# EAGLE design SimpleExt (EAGLE 6.1)
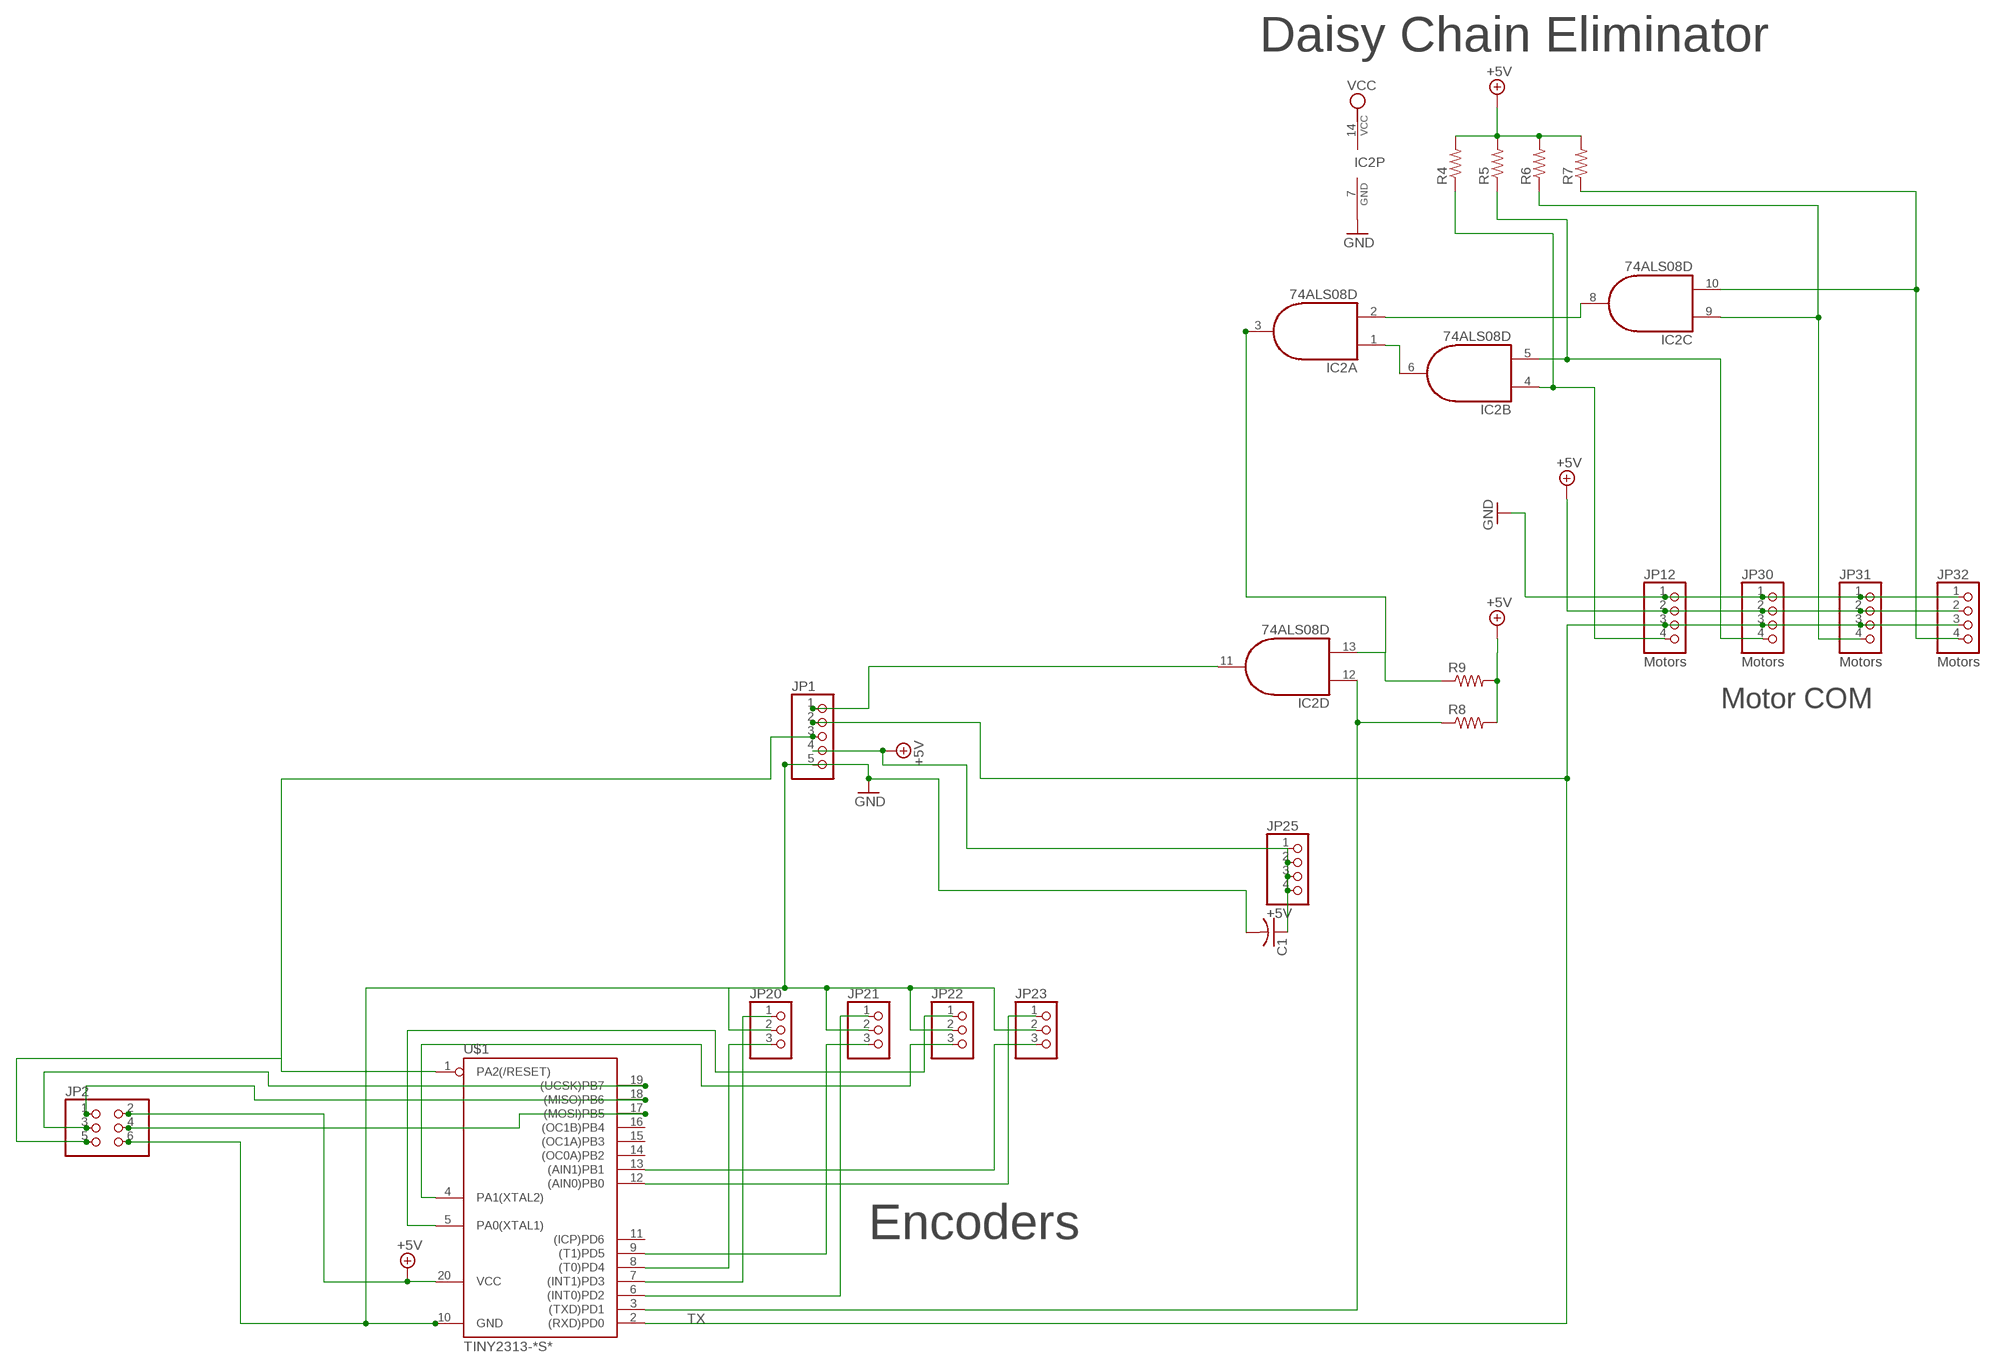
[diagram p0: schematic, sheet 1]

## Parts
C1  C-USC0603K  [C0603K]
IC2  74ALS08D  [SO14]
JP1  PINHD-1X5  [1X05]
JP2  PINHD-2X3  [2X03]
JP12  Motors  PINHD-1X04_2.54-S  [1X04-S]
JP20  PINHD-1X03_2.54-S  [1X03-S]
JP21  PINHD-1X03_2.54-S  [1X03-S]
JP22  PINHD-1X03_2.54-S  [1X03-S]
JP23  PINHD-1X03_2.54-S  [1X03-S]
JP25  +5V  PINHD-1X04_2.54-S  [1X04-S]
JP30  Motors  PINHD-1X04_2.54-S  [1X04-S]
JP31  Motors  PINHD-1X04_2.54-S  [1X04-S]
JP32  Motors  PINHD-1X04_2.54-S  [1X04-S]
R4  R-US_R0603  [R0603]
R5  R-US_R0603  [R0603]
R6  R-US_R0603  [R0603]
R7  R-US_R0603  [R0603]
R8  R-US_R0603  [R0603]
R9  R-US_R0603  [R0603]
U$1  TINY2313-*S*  [SO20L$]

## Nets
+5V [power]: C1.1 JP1.4 JP2.2 JP12.2 JP25.1 JP25.2 JP25.3 JP25.4 JP30.2 JP31.2 JP32.2 R4.2 R5.2 R6.2 R7.2 R8.2 R9.2 U$1.20(VCC)
GND [power]: C1.2 IC2.7(P:GND) JP1.5 JP2.6 JP12.1 JP20.2 JP21.2 JP22.2 JP23.2 JP30.1 JP31.1 JP32.1 U$1.10(GND)
N$1: IC2.11(D:O) JP1.1
N$3: JP2.3 U$1.19((UCSK)PB7)
N$4: IC2.10(C:I1) JP32.4 R7.1
N$5: IC2.9(C:I0) JP31.4 R6.1
N$6: JP2.1 U$1.18((MISO)PB6)
N$8: IC2.1(A:I0) IC2.6(B:O)
N$9: IC2.2(A:I1) IC2.8(C:O)
N$10: IC2.4(B:I0) JP12.4 R4.1
N$11: IC2.12(D:I0) R8.1 U$1.3((TXD)PD1)
N$12: JP20.1 U$1.7((INT1)PD3)
N$14: JP21.1 U$1.6((INT0)PD2)
N$15: JP23.3 U$1.13((AIN1)PB1)
N$16: JP20.3 U$1.8((T0)PD4)
N$17: JP21.3 U$1.9((T1)PD5)
N$18: JP2.4 U$1.17((MOSI)PB5)
N$21: JP23.1 U$1.12((AIN0)PB0)
N$22: JP22.3 U$1.4(PA1(XTAL2))
N$23: JP22.1 U$1.5(PA0(XTAL1))
N$24: IC2.5(B:I1) JP30.4 R5.1
RESET#: JP1.3 JP2.5 U$1.1(PA2(/RESET))
RXD0/IO20*: IC2.3(A:O) IC2.13(D:I1) R9.1
TX: JP1.2 JP12.3 JP30.3 JP31.3 JP32.3 U$1.2((RXD)PD0)
Unconnected: U$1.11((ICP)PD6) U$1.14((OC0A)PB2) U$1.15((OC1A)PB3) U$1.16((OC1B)PB4)

## Notes on the sheet
- Daisy Chain Eliminator
- Motor COM
- Encoders

## Power pins joined to a net without a drawn wire
VCC: IC2.14(P:VCC)

## Library data of the parts
C1 = rcl:C-US: CAPACITOR, American symbol
IC2 = 74xx-us:74*08: Quad 2-input AND gate
JP1 = pinhead:PINHD-1X5: PIN HEADER
JP2 = pinhead:PINHD-2X3: PIN HEADER
JP12 JP25 JP30-JP32 = pinhead-2:PINHD-1X04: PIN HEADER
JP20-JP23 = pinhead-2:PINHD-1X03: PIN HEADER
R4-R9 = rcl:R-US_: RESISTOR, American symbol
U$1 = avr-6:TINY2313*: Atmel Tiny2313 2K Flash, 128 bytes EEPROM, 128 bytes RAM

## Net classes
0 default: width 0.254 mm, drill 0.381 mm, clearance 0.203 mm
1 power: width 0.406 mm, drill 0.381 mm, clearance 0.203 mm

## Board
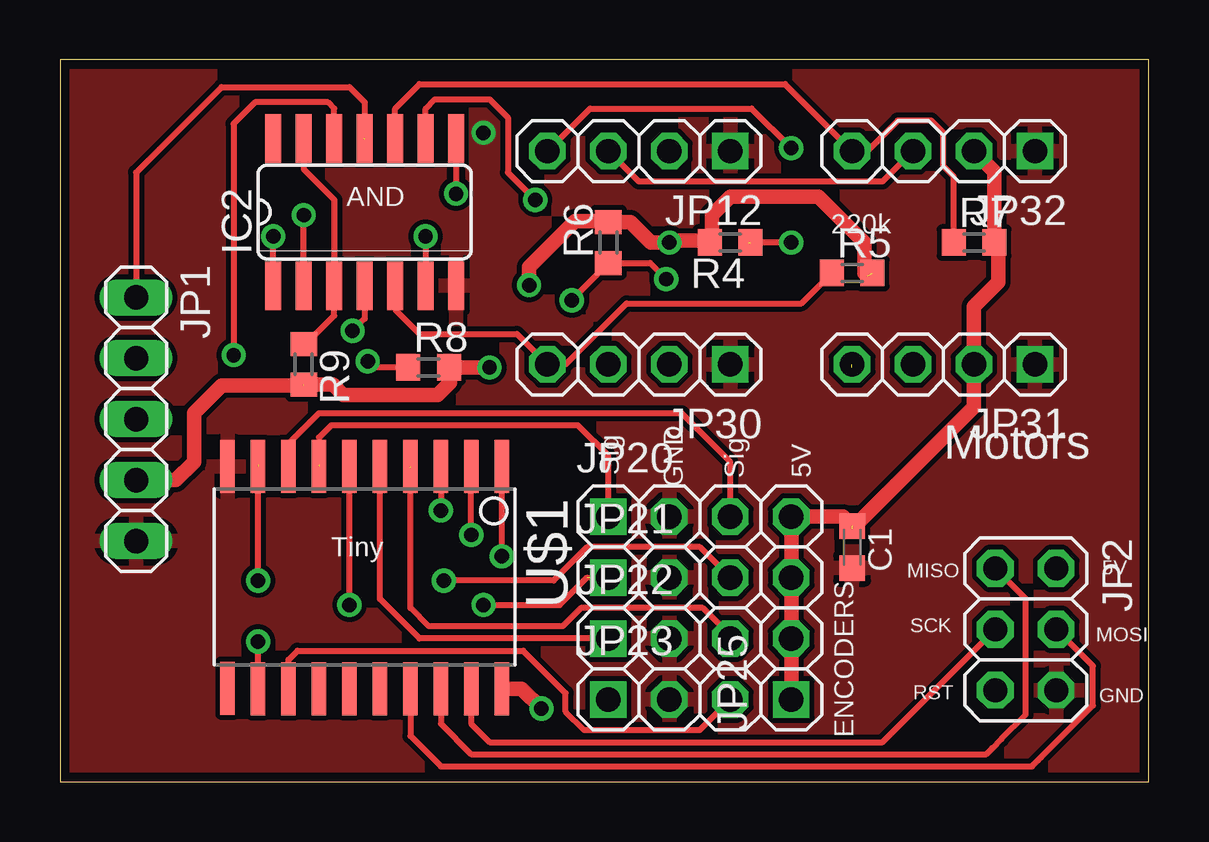
[diagram p1: board, top side]
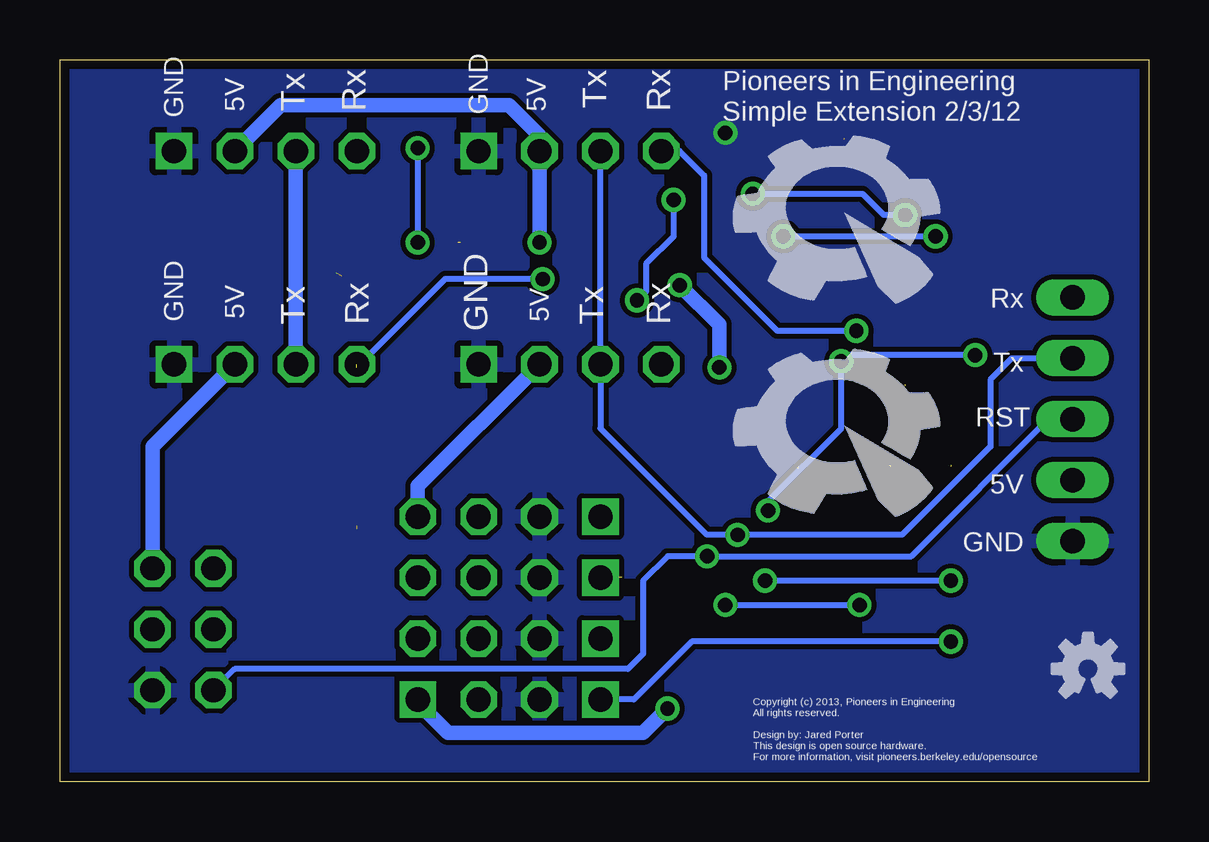
[diagram p2: board, bottom side, seen from below]

Size 45.39 x 30.09 mm. Coordinates in mm from the lower left corner, seen from the top.
Outline: 0,0 45.39,0 45.39,30.09 0,30.09 0,0
Copper layers (1*16): Top 0.035559375mm / dielectric 1.501140625mm / Bottom 0.035559375mm
Design rules "default": minimum track width 10mil, minimum drill 15mil, track to track 6mil, track to pad 6mil, pad to pad 6mil, via to via 6mil, smd to smd 6mil, copper to edge 15mil, drill to drill 8mil, minimum pad ring 10mil, minimum via ring 8mil, stop-mask expansion 4mil, vias tented up to drill 0mil, thermal gap 10mil

### Footprints (pad centres in the part's own frame; a part is rotated, then mirrored left to right if it is on the bottom)
C0603K = smd 1.05 x 1.08: 1 -0.875,0; 2 0.875,0
SO14 = smd 0.66 x 2.032: 1 -3.81,-3.073; 2 -2.54,-3.073; 3 -1.27,-3.073; 4 0,-3.073; 5 1.27,-3.073; 6 2.54,-3.073; 7 3.81,-3.073; 8 3.81,3.073; 9 2.54,3.073; 10 1.27,3.073; 11 0,3.073; 12 -1.27,3.073; 13 -2.54,3.073; 14 -3.81,3.073
1X05 = drill 1.016 long: 1 -5.08,0; 2 -2.54,0; 3 0,0; 4 2.54,0; 5 5.08,0
2X03 = drill 1.016 octagon: 1 -2.54,-1.27; 2 -2.54,1.27; 3 0,-1.27; 4 0,1.27; 5 2.54,-1.27; 6 2.54,1.27
1X04-S = drill 1.016 square: 1 -3.81,0 | drill 1.016 octagon: 2 -1.27,0; 3 1.27,0; 4 3.81,0
1X03-S = drill 1.016 square: 1 -2.54,0 | drill 1.016 octagon: 2 0,0; 3 2.54,0
R0603 = smd 1 x 1.1: 1 -0.85,0; 2 0.85,0
SO20L$ = smd 0.61 x 2.21: 1 -5.715,-4.636; 2 -4.445,-4.636; 3 -3.175,-4.636; 4 -1.905,-4.636; 5 -0.635,-4.636; 6 0.635,-4.636; 7 1.905,-4.636; 8 3.175,-4.636; 9 4.445,-4.636; 10 5.715,-4.636; 11 5.715,4.61; 12 4.445,4.636; 13 3.175,4.636; 14 1.905,4.636; 15 0.635,4.636; 16 -0.635,4.636; 17 -1.905,4.636; 18 -3.175,4.636; 19 -4.445,4.636; 20 -5.715,4.636

### Placement (x,y rotation side)
C1  33.02,9.78 270 top
IC2  12.7,23.75 0 top
JP1  3.17,15.11 270 top
JP2  40.26,6.35 270 top
JP12  24.13,26.29 180 top
JP20  25.4,11.05 0 top
JP21  25.4,8.51 0 top
JP22  25.4,5.97 0 top
JP23  25.4,3.43 0 top
JP25  30.48,7.24 90 top
JP30  24.13,17.4 180 top
JP31  36.83,17.4 180 top
JP32  36.83,26.29 180 top
R4  27.94,22.48 180 top
R5  33.02,21.21 0 top
R6  22.86,22.48 90 top
R7  38.1,22.48 0 top
R8  15.37,17.27 0 top
R9  10.16,17.4 270 top
U$1  12.7,8.51 180 top
U$2  [OSHW-LOGO-S]  2.54,4.7 0 bottom
U$5  [PIE-LOGO-SMALL]  12.7,14.86 0 bottom
U$6  [PIE-LOGO-SMALL]  12.7,23.75 0 bottom

### Tracks (layer width: path | path; a pad name or v marks a point on that pad's centre or on a via)
+5V  (via drill 0.6)  (3 unrouted)
  Top 0.61: U$1.20 19.24,3.87 v20.07,3.05 | JP25.1 JP25.2 JP25.3 JP25.4 32.62,11.05 C1.1 | 33.02,10.54 38.1,15.62 JP31.2 38.1,19.81 39.12,20.83 39.12,22.31 R7.2 38.95,25.44 JP32.2 | v17.91,17.27 R8.2 16.26,17.23 16.26,16.64 15.75,16.13 11.81,16.13 11.39,16.55 R9.2 10.12,16.51 | v19.56,20.7 19.56,21.46 21.46,23.37 22.82,23.37 R6.2 23.79,23.33 24.64,22.48 v25.4,22.48 25.49,22.57 27.18,22.57 | 27.18,22.57 R4.2 | 27.18,22.57 27.18,23.62 27.94,24.38 31.62,24.38 33.53,22.48 33.53,21.21 33.66,21.08 | JP1.4 4.83,12.57 5.59,13.34 5.59,15.37 6.73,16.51 10.16,16.51
  Bottom 0.61: JP25.4 30.48,12.32 JP30.2 | v17.91,17.27 17.91,19.05 v19.56,20.7 | JP32.2 36.2,28.19 26.67,28.19 25.4,26.92 JP12.2 v25.4,22.48 | JP25.1 30.48,3.3 29.21,2.03 21.08,2.03 v20.07,3.05 | JP2.2 41.53,13.97 JP31.2
GND  (via drill 0.6)
  other vias: 17.65,27.05
  pour Top: 0,-0.13 45.34,-0.13 45.34,30.1 0,30.1
  pour Bottom: 0,-0.13 45.34,-0.13 45.34,30.1 0,30.1
N$1  (1 unrouted)
  Top 0.254: 12.7,26.8 12.7,28.32 12.06,28.96 6.73,28.96 3.17,25.4 JP1.1
N$3
  Top 0.254: U$1.19 17.14,2.41 17.91,1.65 34.29,1.65 JP2.3
N$4
  Top 0.254: IC2.10 13.97,28.07 14.99,29.08 30.23,29.08 JP32.4 33.66,26.29 34.92,27.56 36.32,27.56 36.83,27.05 36.83,25.65 37.25,25.23 R7.1
N$5  (via drill 0.6)  (1 unrouted)
  Top 0.254: IC2.9 15.24,28.07 15.62,28.45 17.91,28.45 18.67,27.69 18.67,25.4 v19.81,24.26 | v21.34,20.07 21.34,20.11 R6.1 24.6,21.63 v25.27,20.96
  Bottom 0.254: v19.81,24.26 19.81,22.73 20.95,21.59 20.95,20.45 v21.34,20.07 | v25.27,20.96 29.34,20.96 33.02,17.27
N$6
  Top 0.254: U$1.18 15.88,2.41 17.14,1.14 38.61,1.14 38.86,1.4 39.24,1.78 40.26,2.79 40.26,7.62 JP2.1
N$8  (via drill 0.6)
  Top 0.254: IC2.1 v8.89,22.73 | v15.24,22.73 IC2.6
  Bottom 0.254: v8.89,22.73 v15.24,22.73
N$9  (via drill 0.6)
  Top 0.254: IC2.8 v16.51,24.51 | IC2.2 v10.16,23.62
  Bottom 0.254: v16.51,24.51 11.94,24.51 11.05,23.62 v10.16,23.62
N$10  (via drill 0.6)  (1 unrouted)
  Top 0.254: IC2.4 12.7,19.3 v12.19,18.8 | JP12.4 22.1,28.07 28.83,28.07 v30.48,26.42 | v30.48,22.48 28.7,22.48
  Bottom 0.254: v12.19,18.8 15.49,18.8 18.54,21.84 18.54,25.27 19.56,26.29 JP12.4 | v30.48,26.42 v30.48,22.48
N$11  (via drill 0.6)
  Top 0.254: U$1.3 v15.88,11.3 | R8.1 13.08,17.27 v12.83,17.53 | IC2.12 11.43,28.07 11.18,28.32 8.13,28.32 7.24,27.43 v7.24,17.78
  Bottom 0.254: v15.88,11.3 15.88,11.68 12.83,14.73 v12.83,17.53 12.57,17.78 v7.24,17.78
N$12  (1 unrouted)
  Top 0.254: JP20.1 22.86,13.59 21.59,14.86 11.3,14.86 10.79,14.35 10.79,13.21 10.67,13.08
N$14  (via drill 0.6)  (1 unrouted)
  Top 0.254: JP21.1 22.1,8.51 | v12.06,7.37 U$1.6 | v17.65,7.37 20.83,7.37 21.97,8.51
  Bottom 0.254: v17.65,7.37 v12.06,7.37
N$15
  Top 0.254: U$1.13 9.53,5.08 9.91,5.46 19.3,5.46 21.08,3.68 21.08,2.92 21.84,2.16 26.67,2.16 JP23.3
N$16
  Top 0.254: JP20.3 27.94,13.34 25.91,15.37 10.79,15.37 9.53,14.1 U$1.8
N$17  (via drill 0.6)  (1 unrouted)
  Top 0.254: JP21.3 26.67,9.78 21.97,9.78 20.57,8.38 v16,8.38 | v8.26,8.38 8.26,13.21
  Bottom 0.254: v16,8.38 v8.26,8.38
N$18
  Top 0.254: U$1.17 14.61,1.91 15.88,0.64 40.51,0.64 40.77,0.89 40.89,1.02 43.05,3.17 43.05,4.83 JP2.4
N$21  (via drill 0.6)
  Top 0.254: U$1.12 v8.26,5.84
  Bottom 0.254: v8.26,5.84 19.05,5.84 21.46,3.43 JP23.1
N$22  (1 unrouted)
  Top 0.254: JP22.3 27.94,6.1 26.8,7.24 21.72,7.24 20.95,6.48 15.37,6.48 14.61,7.24 14.61,13.08
N$23
  Top 0.254: U$1.5 13.34,7.62 14.99,5.97 JP22.1
N$24
  Top 0.254: IC2.5 13.97,19.68 14.99,18.67 19.05,18.67 JP30.4 21.08,17.4 23.62,19.94 30.9,19.94 R5.1
RESET#  (via drill 0.6)
  Top 0.254: U$1.1 v18.41,9.4
  Bottom 0.254: JP2.5 38.1,4.7 21.72,4.7 21.08,5.33 21.08,8.38 20.07,9.4 v18.41,9.4 9.91,9.4 4.19,15.11 JP1.3
RXD0/IO20*
  Top 0.254: IC2.13 10.16,25.53 11.43,24.26 IC2.3 11.43,19.43 10.25,18.25 R9.1
TX  (via drill 0.6)
  Top 0.254: v17.14,10.29 U$1.2 | JP32.3 34.29,25.02 24.13,25.02 JP12.3
  Bottom 0.254: JP12.3 JP30.3 22.86,14.73 18.41,10.29 v17.14,10.29 10.29,10.29 6.6,13.97 6.6,16.76 5.71,17.65 JP1.2
  Bottom 0.61: JP31.3 JP32.3

### Text on the board
tPlace: AND | 220k | GND | Sig | Sig | 5V | Motors | Tiny | ENCODERS | MISO | 5V | SCK | MOSI | RST | GND
bPlace: Pioneers in Engineering | Rx | Tx | 5V | Rx | Tx | 5V | Simple Extension 2/3/12 | GND | GND | Rx | Rx | Tx | 5V | Rx | Tx | 5V | GND | Tx | GND | RST | 5V | GND | Copyright (c) 2013, Pioneers in Engineering / All rights reserved. / / Design by: Jared Porter / This design is open source hardware. / For more information, visit pioneers.berkeley.edu/opensource